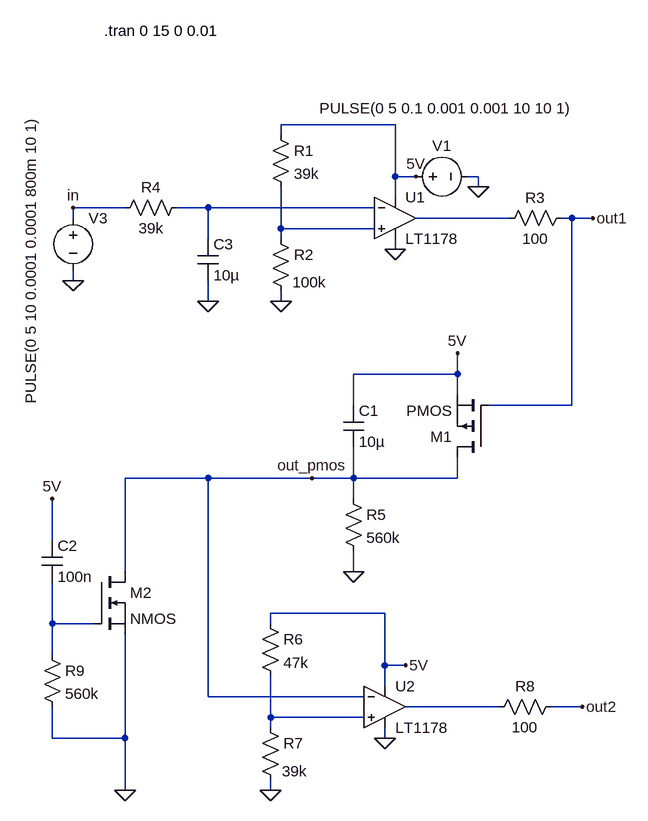
[diagram p0: schematic BSPD.asc]
BSPD.asc, the LTspice schematic file:
Version 4
SHEET 1 880 1044
WIRE 208 0 32 0
WIRE 32 16 32 0
WIRE 208 80 208 0
WIRE 240 80 208 80
WIRE 336 80 320 80
WIRE 336 96 336 80
WIRE 208 112 208 80
WIRE -208 128 -288 128
WIRE -80 128 -128 128
WIRE 176 128 -80 128
WIRE -288 144 -288 128
WIRE 384 144 240 144
WIRE 480 144 464 144
WIRE 512 144 480 144
WIRE 32 160 32 96
WIRE 176 160 32 160
WIRE -80 176 -80 128
WIRE 32 176 32 160
WIRE 208 192 208 176
WIRE -288 240 -288 224
WIRE -80 272 -80 240
WIRE 32 272 32 256
WIRE 304 384 304 352
WIRE 304 384 144 384
WIRE 304 416 304 384
WIRE 144 432 144 384
WIRE 480 432 480 144
WIRE 480 432 352 432
WIRE -80 544 -208 544
WIRE 80 544 -80 544
WIRE 144 544 144 496
WIRE 144 544 80 544
WIRE 304 544 304 512
WIRE 304 544 144 544
WIRE 144 576 144 544
WIRE -320 640 -320 576
WIRE -208 688 -208 544
WIRE 144 688 144 656
WIRE 192 752 16 752
WIRE -320 768 -320 704
WIRE -256 768 -320 768
WIRE 16 768 16 752
WIRE -320 816 -320 768
WIRE 192 832 192 752
WIRE 224 832 192 832
WIRE 192 864 192 832
WIRE -80 880 -80 544
WIRE 160 880 -80 880
WIRE 368 896 224 896
WIRE 496 896 448 896
WIRE 16 912 16 848
WIRE 160 912 16 912
WIRE 16 928 16 912
WIRE -320 944 -320 896
WIRE -208 944 -208 784
WIRE -208 944 -320 944
WIRE 192 944 192 928
WIRE -208 1024 -208 944
WIRE 16 1024 16 1008
FLAG 208 192 0
FLAG 336 96 0
FLAG 32 272 0
FLAG -288 240 0
FLAG 512 144 out1
FLAG -288 128 in
FLAG 240 80 5V
FLAG 304 352 5V
FLAG 144 688 0
FLAG 80 544 out_pmos
FLAG 192 944 0
FLAG 16 1024 0
FLAG 496 896 out2
FLAG 224 832 5V
FLAG -208 1024 0
FLAG -320 576 5V
FLAG -80 272 0
SYMBOL Opamps\\LT1178 208 80 R0
SYMATTR InstName U1
SYMBOL voltage 224 80 R270
WINDOW 0 32 56 VTop 2
WINDOW 3 121 63 VBottom 2
WINDOW 123 0 0 Left 0
WINDOW 39 0 0 Left 0
SYMATTR InstName V1
SYMATTR Value PULSE(0 5 0.1 0.001 0.001 10 10 1)
SYMBOL res 16 0 R0
SYMATTR InstName R1
SYMATTR Value 39k
SYMBOL res 16 160 R0
WINDOW 3 34 83 Left 2
SYMATTR Value 100k
SYMATTR InstName R2
SYMBOL res 480 128 R90
WINDOW 0 0 56 VBottom 2
WINDOW 3 32 56 VTop 2
SYMATTR InstName R3
SYMATTR Value 100
SYMBOL res -112 112 R90
WINDOW 0 0 56 VBottom 2
WINDOW 3 32 56 VTop 2
SYMATTR InstName R4
SYMATTR Value 39k
SYMBOL voltage -288 128 R0
WINDOW 3 -65 -144 VRight 2
WINDOW 123 0 0 Left 0
WINDOW 39 0 0 Left 0
SYMATTR Value PULSE(0 5 10 0.0001 0.0001 800m 10 1)
SYMATTR InstName V3
SYMBOL pmos 352 512 R180
SYMATTR InstName M1
SYMBOL res 128 560 R0
SYMATTR InstName R5
SYMATTR Value 560k
SYMBOL cap 128 432 R0
SYMATTR InstName C1
SYMATTR Value 10µ
SYMBOL Opamps\\LT1178 192 832 R0
SYMATTR InstName U2
SYMBOL res 0 752 R0
SYMATTR InstName R6
SYMATTR Value 47k
SYMBOL res 0 912 R0
WINDOW 3 34 83 Left 2
SYMATTR Value 39k
SYMATTR InstName R7
SYMBOL res 464 880 R90
WINDOW 0 0 56 VBottom 2
WINDOW 3 32 56 VTop 2
SYMATTR InstName R8
SYMATTR Value 100
SYMBOL nmos -256 688 R0
SYMATTR InstName M2
SYMBOL res -336 800 R0
SYMATTR InstName R9
SYMATTR Value 560k
SYMBOL cap -336 640 R0
SYMATTR InstName C2
SYMATTR Value 100n
SYMBOL cap -96 176 R0
SYMATTR InstName C3
SYMATTR Value 10µ
TEXT -240 -144 Left 2 !.tran 0 15 0 0.01

The netlist it stands for:
* BSPD.asc
XU1 N003 N001 5V 0 N002 LT1178  ; pins In+ In- V+ V- OUT
V1 5V 0 PULSE(0 5 0.1 0.001 0.001 10 10 1)
R1 5V N003 39k
R2 N003 0 100k
R3 out1 N002 100
R4 N001 in 39k
V3 in 0 PULSE(0 5 10 0.0001 0.0001 800m 10 1)
M1 out_pmos out1 5V 5V PMOS
R5 out_pmos 0 560k
C1 5V out_pmos 10µ
XU2 N006 out_pmos 5V 0 N005 LT1178  ; pins In+ In- V+ V- OUT
R6 5V N006 47k
R7 N006 0 39k
R8 out2 N005 100
M2 out_pmos N004 0 0 NMOS
R9 N004 0 560k
C2 5V N004 100n
C3 N001 0 10µ
.model NMOS NMOS
.model PMOS PMOS
.lib standard.mos
.tran 0 15 0 0.01
.backanno
.end